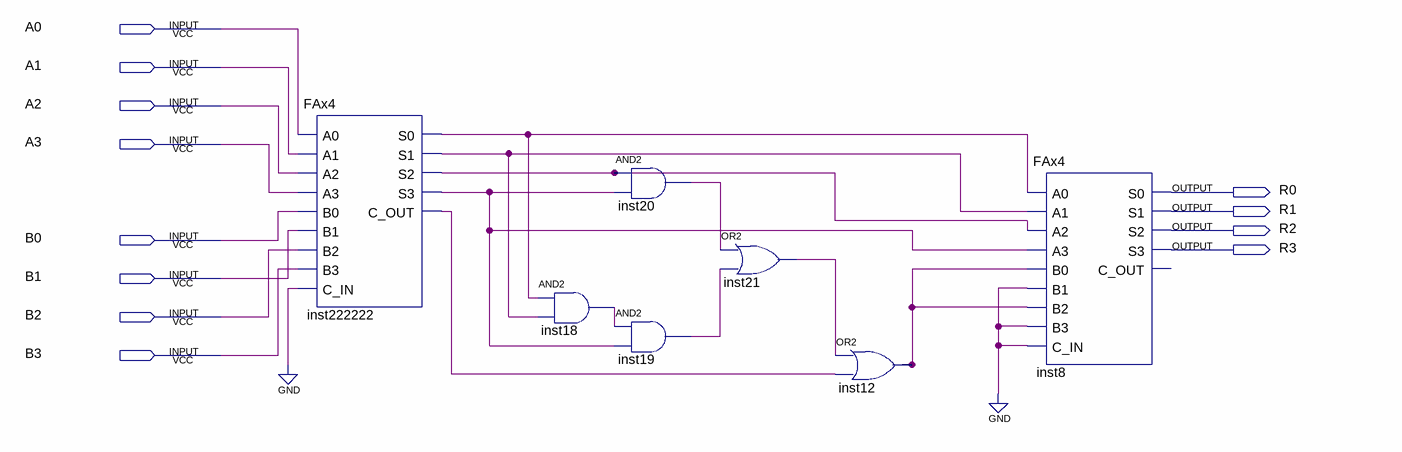
[diagram p0: schematic sheet]
// Quartus schematic FAx4_MOD_11.bdf as structural Verilog: 7 symbols, 12 pins
module FAx4_MOD_11 (
  input  A0,
  input  A1,
  input  A2,
  input  A3,
  input  B0,
  input  B1,
  input  B2,
  input  B3,
  output R0,
  output R1,
  output R2,
  output R3
);

  wire inst12_out, inst18_out, inst19_out, inst20_out, inst21_out, inst222222_c_out, inst222222_s0,
       inst222222_s1, inst222222_s2, inst222222_s3;

  FAx4 inst222222 (
    .A0(A0), .A1(A1), .A2(A2), .A3(A3), .B0(B0), .B1(B1), .B2(B2), .B3(B3), .C_IN(1'b0), .S0(inst222222_s0),
    .S1(inst222222_s1), .S2(inst222222_s2), .S3(inst222222_s3), .C_OUT(inst222222_c_out));
  and inst18 (inst18_out, inst222222_s0, inst222222_s1);
  and inst20 (inst20_out, inst222222_s2, inst222222_s3);
  and inst19 (inst19_out, inst18_out, inst222222_s3);
  or inst21 (inst21_out, inst20_out, inst19_out);
  or inst12 (inst12_out, inst21_out, inst222222_c_out);
  FAx4 inst8 (
    .A0(inst222222_s0), .A1(inst222222_s1), .A2(inst222222_s2), .A3(inst222222_s3), .B0(inst12_out),
    .B1(1'b0), .B2(inst12_out), .B3(1'b0), .C_IN(1'b0), .S0(R0), .S1(R1), .S2(R2), .S3(R3));  // open: C_OUT
endmodule
